# EAGLE design esp_round_lcd (EAGLE 7.7.0)
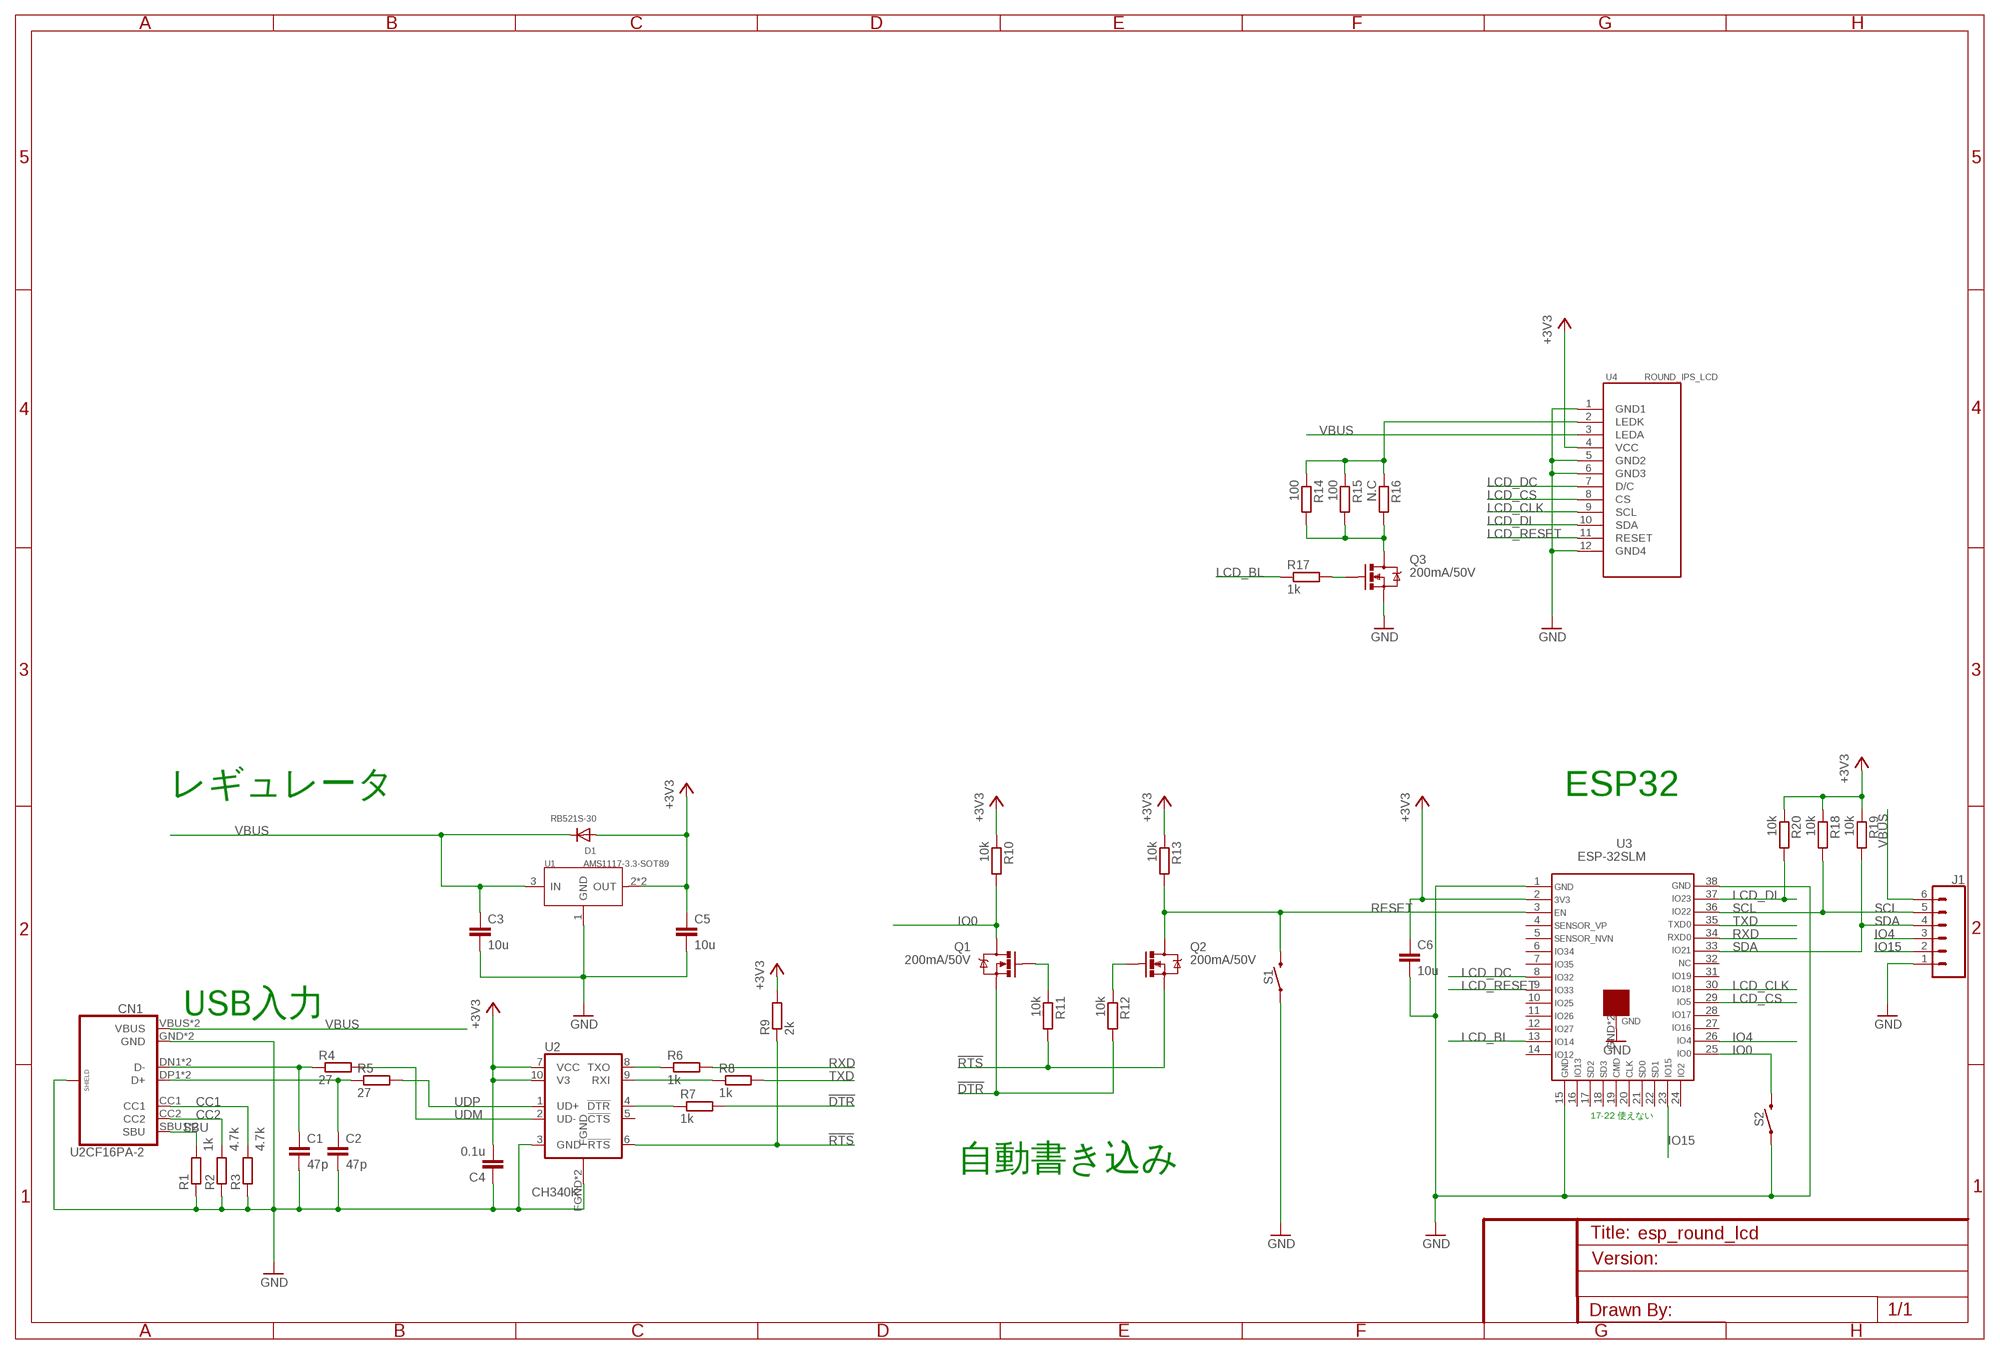
[diagram p0: schematic, sheet 1]

## Parts
C1  47p  C-EU-C1608  [C1608]
C2  47p  C-EU-C1608  [C1608]
C3  10u  C-EU-C1608  [C1608]
C4  0.1u  C-EU-C1608  [C1608]
C5  10u  C-EU-C1608  [C1608]
C6  10u  C-EU-C1608  [C1608]
CN1  U2CF16PA-2  [U2CF16PA]
D1  RB521S-30  DIODESOD-523  [SOD-523]
J1  CONN_06SILK_FEMALE_PTH  [1X06]
Q1  200mA/50V  MOSFET-NCHANNELBSS138  [SOT23-3]
Q2  200mA/50V  MOSFET-NCHANNELBSS138  [SOT23-3]
Q3  200mA/50V  MOSFET-NCHANNELBSS138  [SOT23-3]
R1  1k  R-EU_R0603  [R0603]
R2  4.7k  R-EU_R0603  [R0603]
R3  4.7k  R-EU_R0603  [R0603]
R4  27  R-EU_R0603  [R0603]
R5  27  R-EU_R0603  [R0603]
R6  1k  R-EU_R0603  [R0603]
R7  1k  R-EU_R0603  [R0603]
R8  1k  R-EU_R0603  [R0603]
R9  2k  R-EU_R0603  [R0603]
R10  10k  R-EU_R0603  [R0603]
R11  10k  R-EU_R0603  [R0603]
R12  10k  R-EU_R0603  [R0603]
R13  10k  R-EU_R0603  [R0603]
R14  100  R-EU_R0603  [R0603]
R15  100  R-EU_R0603  [R0603]
R16  N.C  R-EU_R0603  [R0603]
R17  1k  R-EU_R0603  [R0603]
R18  10k  R-EU_R0603  [R0603]
R19  10k  R-EU_R0603  [R0603]
R20  10k  R-EU_R0603  [R0603]
S1  TACT_SW_3X4  [TACTILE_SWITCH_SMD_3X4MM]
S2  TACT_SW_3X4  [TACTILE_SWITCH_SMD_3X4MM]
U1  AMS1117-3.3-SOT89  AMS1117-3.3(SOT-89)  [SOT-89]
U2  CH340K  [ESSOP10]
U3  ESP-32SLM  [ESP32D-SLM]
U4  ROUND_IPS_LCD  [ROUND_IPS_LCD]

## Nets
!DTR: Q1.2(S) R7.2 R12.2
!RTS: Q2.2(S) R9.1 R11.2 U2.6(!RTS)
+3V3 [pow]: C4.2 C5.1 C6.1 D1.A R9.2 R10.1 R13.1 R18.1 R19.1 R20.1 U1.2(OUT) U1.4(OUT) U2.7(VCC) U2.10(V3) U3.2 U4.4(VCC)
CC1: CN1.CC1 R3.2
CC2: CN1.CC2 R2.2
DM: C1.1 CN1.DN1(D-) CN1.DN2(D-) R4.1
DP: C2.1 CN1.DP1(D+) CN1.DP2(D+) R5.1
GND: C1.2 C2.2 C3.2 C4.1 C5.2 C6.2 CN1.GND CN1.GND1(GND) CN1.GND@9(SHIELD) CN1.GND@10(SHIELD) CN1.GND@11(SHIELD) CN1.GND@12(SHIELD) CN1.GND@13(SHIELD) CN1.GND@14(SHIELD) CN1.GND@15(SHIELD) CN1.GND@16(SHIELD) J1.1 Q3.2(S) R1.1 R2.1 R3.1 S1.1 S1.2 S2.1 S2.2 U1.1(GND) U2.3(GND) U2.FGND U2.FGND2(FGND) U3.1 U3.15 U3.38 U3.GND U3.GND2 U4.1(GND1) U4.5(GND2) U4.6(GND3) U4.12(GND4)
IO0: Q1.3(D) R10.2 S2.3 S2.4 U3.25
IO4: J1.3 U3.26
IO15: J1.2 U3.23
LCD_BL: R17.1 U3.13
LCD_CLK: U3.30 U4.9(SCL)
LCD_CS: U3.29 U4.8(CS)
LCD_DC: U3.8 U4.7(D/C)
LCD_DI: R20.2 U3.37 U4.10(SDA)
LCD_RESET: U3.9 U4.11(RESET)
LED_K [usbvcc]: R14.1 R15.1 R16.1 U4.2(LEDK)
N$1: Q3.1(G) R17.2
N$2 [usbvcc]: Q3.3(D) R14.2 R15.2 R16.2
N$7: R8.1 U2.9(RXI)
N$11: R6.1 U2.8(TXO)
N$13: Q2.1(G) R12.1
N$14: Q1.1(G) R11.1
N$16: R7.1 U2.4(!DTR)
RESET: Q2.3(D) R13.2 S1.3 S1.4 U3.3
RXD: R6.2 U3.34
SBU: CN1.SBU1(SBU) CN1.SBU2(SBU) R1.2
SCL: J1.5 R18.2 U3.36
SDA: J1.4 R19.2 U3.33
TXD: R8.2 U3.35
UDM: R4.2 U2.2(UD-)
UDP: R5.2 U2.1(UD+)
VBUS [usbvcc]: C3.1 CN1.VBUS CN1.VBUS1(VBUS) D1.K(C) J1.6 U1.3(IN) U4.3(LEDA)
Unconnected: U2.5(!CTS) U3.4 U3.5 U3.6 U3.7 U3.10 U3.11 U3.12 U3.14 U3.16 U3.17 U3.18 U3.19 U3.20 U3.21 U3.22 U3.24 U3.27 U3.28 U3.31 U3.32

## Notes on the sheet
- レギュレータ | ESP32
- USB入力
- 17-22 使えない
- 自動書き込み

## Library data of the parts
C1-C6 = BS21Lab-Capacitors:C-EU-: CAPACITOR, European symbol
CN1 = suna_lib:U2CF16PA-2
D1 = adafruit:DIODE: Diode SMADIODE - SMA Surface Mount Package 20V 1A Schottky Diode Digikey: 641-1014-6-ND DO-1N4148 - Through Hole Small Current Diode SOD-123 20V 1 A (.5mV Vf) Schottky Diode - Digikey: MBRX120TPMSCT-ND SOD-323 10V 570mA (.38mV Vf, 3ns) Schottky Diode - Digikey: ZLLS410CT-ND SOD-523 30V 30mA Schottky Diode (RB751S-40TE61) - Digikey: RB751S-40TE61CT-ND SOT23-R/W - SOT23 Package (R = Solder Paste/Reflow Ovens, W = Hand-Soldering) BAT54Film 40V 300mA - Digikey: 497-7162-1-ND
J1 = SparkFun-Connectors:CONN_06: Multi connection point. Often used as Generic Header-pin footprint for 0.1 inch spaced/style header connections On any of the 0.1 inch spaced packages, you can populate with these: Break Away Headers - Straight <https://www.sparkfun.com/products/116> (PRT-00116) Break Away Male Headers - Right Angle <https://www.sparkfun.com/products/553> (PRT-00553) Female Headers <https://www.sparkfun.com/products/115> (PRT-00115) Break Away Headers - Machine Pin <https://www.sparkfun.com/products/117> (PRT-00117) Break Away Female Headers - Swiss Machine Pin <https://www.sparkfun.com/products/743> (PRT-00743) Arduino Stackable Header - 6 Pin <https://www.sparkfun.com/products/9280> (PRT-09280) For SCREWTERMINALS and SPRING TERMINALS visit here: Screw Terimnals on SparkFun.com <https://www.sparkfun.com/search/results?term=Screw+Terminals> (5mm/3.5mm/2.54mm spacing) This device is also useful as a general connection point to wire up your design to another part of your project. Our various solder wires solder well into these plated through hole pads. Hook-Up Wire - Assortment (Stranded, 22 AWG) <https://www.sparkfun.com/products/11375> (PRT-11375) Hook-Up Wire - Assortment (Solid Core, 22 AWG) <https://www.sparkfun.com/products/11367> (PRT-11367) View the entire wire category on our website here <https://www.sparkfun.com/categories/141>; PROD_ID: CONN-08437
Q1 Q2 = SparkFun-DiscreteSemi:MOSFET-NCHANNEL: Common NMOSFET Parts MFG P/N Store ID Prod ID FDD8780 TRANS-09984 SI7820DN TRANS-11055 FDS6630A IC-08089 2N7002PW TRANS-11151 FQP30N06L COM-10213 TRANS-10060 BSS123LT1G TRANS-08345 BSS138 TRANS-00830 BS170 2N7000; PROD_ID: TRANS-00830
Q3 = suna_lib:MOSFET-NCHANNEL: Common NMOSFET Parts MFG P/N Store ID Prod ID FDD8780 TRANS-09984 SI7820DN TRANS-11055 FDS6630A IC-08089 2N7002PW TRANS-11151 FQP30N06L COM-10213 TRANS-10060 BSS123LT1G TRANS-08345 BSS138 TRANS-00830 BS170 2N7000; PROD_ID: TRANS-00830
R1-R20 = resistor:R-EU_: RESISTOR, European symbol
S1 S2 = suna_lib:TACT_SW_3X4
U1 = suna_lib:AMS1117-3.3(SOT-89): 310030095; MPN: AMS1117-3.3
U2 = suna_lib:CH340K
U3 = suna_lib:ESP-32
U4 = suna_lib:ROUND_IPS_LCD

## Net classes
1 pow: width 0.508 mm
2 GND: width 0.61 mm
3 usbvcc: width 0.508 mm, clearance 0.254 mm
4 aref: width 0.406 mm, clearance 0.254 mm

## Board
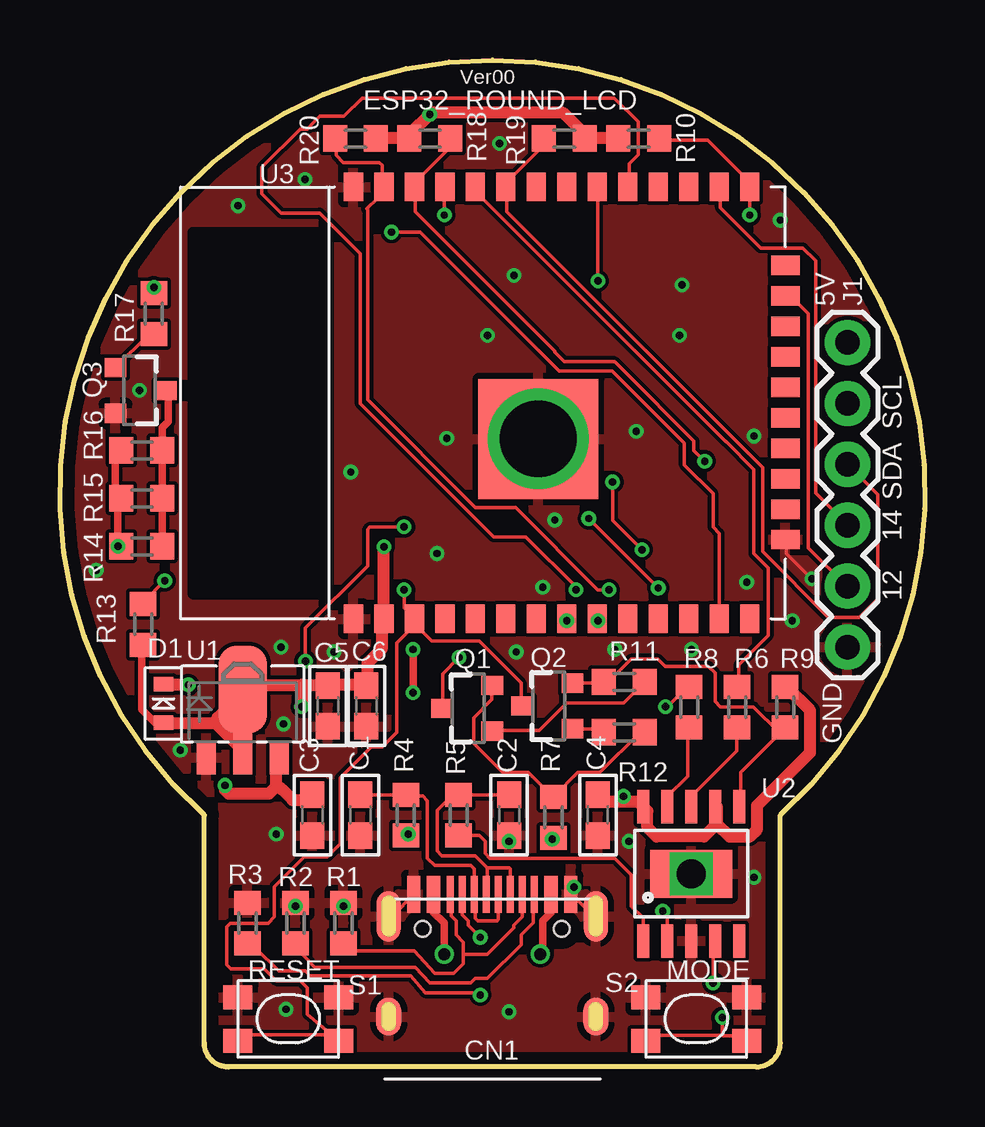
[diagram p1: board, top side]
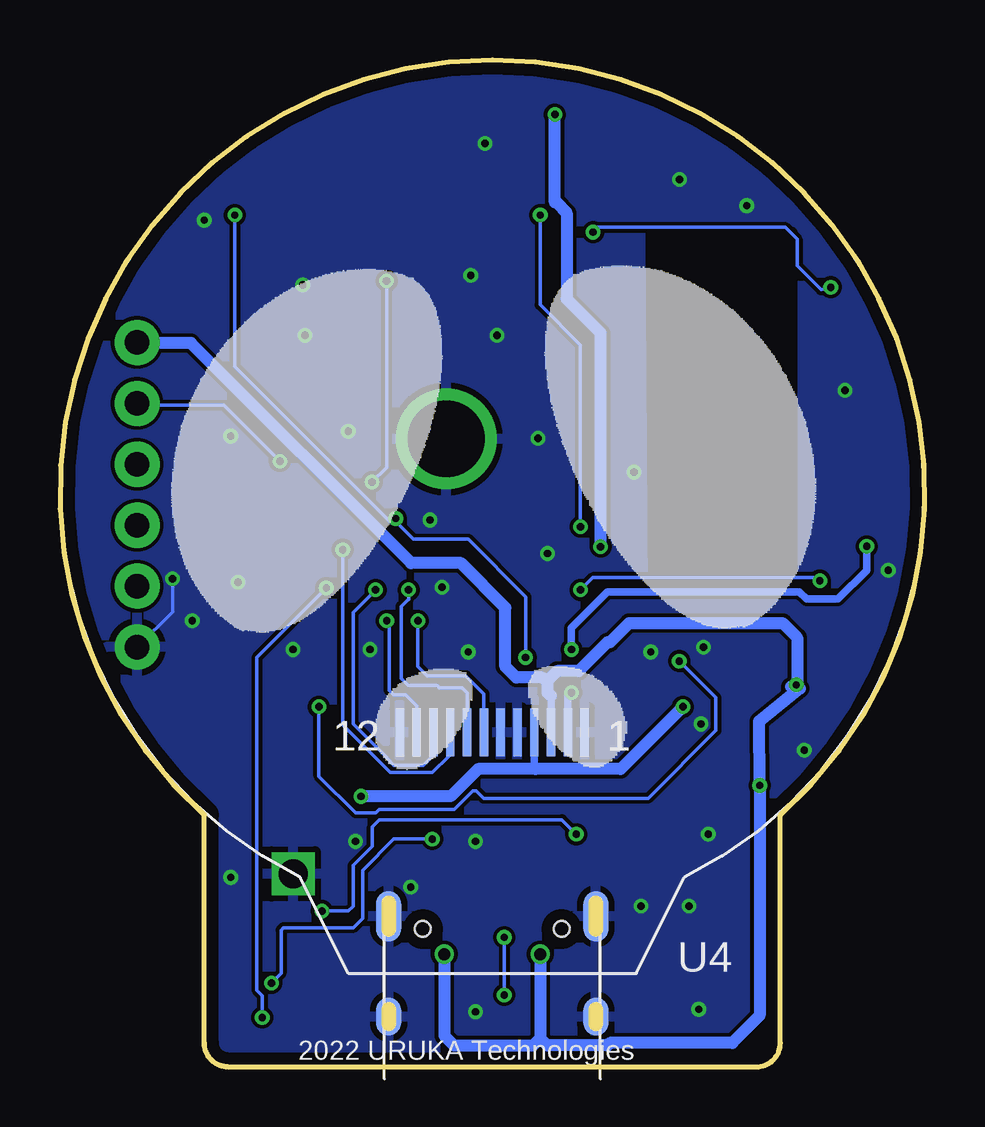
[diagram p2: board, bottom side, seen from below]

Size 36.02 x 41.98 mm. Coordinates in mm from the lower left corner, seen from the top.
Outline: 29.01,0 7.01,0 arc-90 6.01,1 6.01,10.5 arc-277 30.01,10.5 30.01,1 arc-90 29.01,0
Copper layers (1*16): Top 0.035mm / dielectric 1.53mm / Bottom 0.035mm
Design rules "seeed_pban_5mil": minimum track width 6mil, minimum drill 12mil, track to track 6mil, track to pad 0.229mm, pad to pad 6mil, via to via 6mil, smd to smd 5mil, copper to edge 0.5mm, drill to drill 0.5mm, minimum pad ring 10mil, minimum via ring 6mil, stop-mask expansion 4mil, vias tented up to drill 25mil, thermal gap 10mil
tRestrict: area 5.5,19.7 to 11.2,34.8
bRestrict: area 5.5,19.7 to 11.4,34.8

### Footprints (pad centres in the part's own frame; a part is rotated, then mirrored left to right if it is on the bottom)
C1608 = smd 1.1 x 1: 1 -0.85,0; 2 0.85,0
U2CF16PA = smd 1.55 x 0.3: CC1 7.695,1.25; CC2 7.695,-1.75; DN1 7.695,-0.25; DN2 7.695,0.75; DP1 7.695,0.25; DP2 7.695,-0.75; SBU1 7.695,-1.25; SBU2 7.695,1.75 | smd 1.55 x 0.55: GND 7.695,3.27; GND1 7.695,-3.27 | smd 1.6 x 1.05: GND@9 2.6,4.32; GND@11 2.6,-4.32 | smd 2.1 x 1: GND@10 6.78,4.32; GND@12 6.78,-4.32 | smd 1.6 x 1.05 bottom: GND@13 2.6,4.32; GND@15 2.6,-4.32 | smd 2.1 x 1.05 bottom: GND@14 6.78,4.32; GND@16 6.78,-4.32 | smd 1.55 x 0.56: VBUS 7.695,2.45; VBUS1 7.695,-2.45 | hole 0.65: 6.25,-2.89; 6.25,2.89
SOD-523 = smd 0.8 x 0.6: A 0,-0.8; K 0,0.8
1X06 = drill 1.016 pad 1.88: 1 0,0; 2 2.54,0; 3 5.08,0; 4 7.62,0; 5 10.16,0; 6 12.7,0
SOT23-3 = smd 0.8 x 0.9: 1 -0.95,-1; 2 0.95,-1; 3 0,1.1
R0603 = smd 1 x 1.1: 1 -0.85,0; 2 0.85,0
TACTILE_SWITCH_SMD_3X4MM = smd 1.2 x 1: 1 -2.1,-0.9; 2 2.1,-0.9; 3 2.1,0.9; 4 -2.1,0.9
SOT-89 = smd 0.8 x 1.4: 1 -1.524,-1.905; 3 1.524,-1.905 | smd 0.8 x 1.9: 2 0,-1.651 | smd 2.032 x 3.65: 4 0,0.94
ESSOP10 = smd 0.5 x 1.4: 1 -2,-2.8; 2 -1,-2.8; 3 0,-2.8; 4 1,-2.8; 5 2,-2.8; 6 2,2.8; 7 1,2.8; 8 0,2.8; 9 -1,2.8; 10 -2,2.8 | smd 3.4 x 2: FGND 0,0 | drill 1.2 square: FGND2 0,0
ESP32D-SLM = smd 1.2 x 0.8: 1 0,0; 2 0,-1.27; 3 0,-2.54; 4 0,-3.81; 5 0,-5.08; 6 0,-6.35; 7 0,-7.62; 8 0,-8.89; 9 0,-10.16; 10 0,-11.43; 11 0,-12.7; 12 0,-13.97; 13 0,-15.24; 14 0,-16.51; 25 18,-16.51; 26 18,-15.24; 27 18,-13.97; 28 18,-12.7; 29 18,-11.43; 30 18,-10.16; 31 18,-8.89; 32 18,-7.62; 33 18,-6.35; 34 18,-5.08; 35 18,-3.81; 36 18,-2.54; 37 18,-1.27; 38 18,0 | smd 0.8 x 1.2: 15 3.3,-18; 16 4.57,-18; 17 5.84,-18; 18 7.11,-18; 19 8.38,-18; 20 9.65,-18; 21 10.92,-18; 22 12.19,-18; 23 13.46,-18; 24 14.73,-18 | smd 5 x 5: GND 7.5,-7.7 | drill 3.2: GND2 7.5,-7.7
ROUND_IPS_LCD = smd 0.35 x 2: 1 3.85,-9.95; 2 3.15,-9.95; 3 2.45,-9.95; 4 1.75,-9.95; 5 1.05,-9.95; 6 0.35,-9.95; 7 -0.35,-9.95; 8 -1.05,-9.95; 9 -1.75,-9.95; 10 -2.45,-9.95; 11 -3.15,-9.95; 12 -3.85,-9.95

### Placement (x,y rotation side)
C1  12.51,10.5 270 top
C2  18.71,10.5 270 top
C3  10.51,10.5 270 top
C4  22.41,10.5 90 top
C5  11.16,15.05 270 top
C6  12.76,15.05 270 top
CN1  18.01,-0.5 90 top
D1  4.31,15.15 0 top
J1  32.81,17.5 90 top
Q1  17.01,14.95 90 top
Q2  20.36,15.05 90 top
Q3  3.31,28.2 270 top
R1  11.81,6 270 top
R2  9.81,6 270 top
R3  7.81,6 270 top
R4  14.41,10.5 270 top
R5  16.61,10.5 270 top
R6  28.21,15 90 top
R7  20.56,10.4 90 top
R8  26.21,15 90 top
R9  30.21,15 90 top
R10  24.11,38.7 0 top
R11  23.51,16.05 180 top
R12  23.51,13.95 0 top
R13  3.46,18.45 90 top
R14  3.41,21.7 0 top
R15  3.41,23.7 0 top
R16  3.41,25.7 0 top
R17  3.91,31.4 270 top
R18  15.41,38.7 0 top
R19  21.01,38.7 180 top
R20  12.31,38.7 180 top
S1  9.51,2 180 top
S2  26.51,2 180 top
U1  7.61,14.8 0 top
U2  26.3,8.05 0 top
U3  12.23,18.68 90 top
U4  18.01,23.9 0 bottom
U$1  [OSHIOKI]  34.01,9 0 bottom

### Tracks (layer width: path | path; a pad name or v marks a point on that pad's centre or on a via)
!DTR
  Top 0.152: Q1.2 18,15.85 18,15.32 17.23,14.55 17.23,13.49 18.45,12.27 19.52,12.27 20.51,11.28 R7.2 20.59,11.28 21.58,12.27 22.49,12.27 24.17,13.95 24.32,13.95 R12.2
!RTS
  Top 0.152: U2.6 28.36,10.9 28.36,12.27 30.19,14.1 R9.1 29.96,13.95 28.89,15.01 27.52,15.01 27.29,15.24 27.29,16.42 27.01,16.7 25.21,16.7 24.91,17 23.79,17 22.87,16.08 22.72,16.08 R11.2 22.64,16 21.42,16 Q2.2
+3V3  (via drill 0.3)
  Top 0.254: 3.41,17.75 3.46,17.75 R13.1
  Top 0.305: D1.A 3.96,14.35 3.41,14.9 3.41,17.75
  Top 0.508: 6.49,14.33 4.36,14.33 D1.A | 6.49,14.33 7.63,13.18 U1.2 | 7.56,16.38 7.56,15.77 U1.4 | 6.49,14.33 6.57,14.55 7.56,15.54 U1.4 | 10.07,15.93 7.78,15.93 U1.4 | 10.07,15.93 10.91,15.93 C5.1 11.21,15.93 12.74,15.93 C6.1 12.81,16.15 12.81,16.84 13.42,17.45 13.42,18.67 U3.2 13.5,18.9 v13.5,21.69 | 23.48,11.05 24.09,11.05 24.24,10.9 U2.10 24.47,10.67 24.47,9.98 24.85,9.6 26.83,9.6 27.37,10.13 | 23.48,11.05 22.42,11.05 C4.2 | 27.37,10.13 27.9,9.6 28.74,9.6 29.04,9.91 29.04,10.9 31.25,13.11 31.25,14.86 30.26,15.85 R9.2 | 27.37,10.13 27.37,10.82 U2.7 | R20.1 13.2,38.71 14.49,38.71 R18.1 14.64,38.94 v15.4,39.7 15.48,39.78 20.97,39.78 21.81,38.94 R19.1 21.88,38.71 R10.1 | 10.07,15.93 v10.07,15.01 | v23.48,11.28 23.48,11.05
  Bottom 0.305: U4.4 16.26,12.47 16.21,12.42
  Bottom 0.508: v15.4,39.7 15.4,36.04 15.36,36.04 14.91,35.6 14.91,32.01 13.5,30.6 v13.5,21.69 | v23.48,11.28 19.75,11.28 18.61,12.42 16.21,12.42 12.66,12.42 v10.07,15.01
CC1  (via drill 0.3)
  Top 0.152: R3.2 8.16,4.95 9.11,4 10.21,4 10.41,3.8 14.61,3.8 15.21,3.1 17.41,3.1 v17.51,3 | CN1.CC1 16.76,6.35 17.01,6.1 17.01,5.9 v17.51,5.4
  Bottom 0.152: v17.51,5.4 v17.51,3
CC2
  Top 0.152: R2.2 9.86,4.95 10.61,4.15 14.81,4.15 15.41,3.5 17.11,3.5 17.31,3.7 17.81,3.7 19.21,5.1 19.21,5.5 19.71,6 19.71,7.14 CN1.CC2
DM
  Top 0.152: C1.1 R4.1 14.56,11.3 15.11,11.3 15.31,11.1 15.31,8.7 15.61,8.4 17.11,8.4 17.26,8.25 CN1.DN2 17.31,7.14 17.31,6.2 17.41,6.1 18.21,6.1 18.26,6.15 CN1.DN1
DP
  Top 0.152: 18.76,11.05 C2.1 R5.1 | 17.81,7.14 CN1.DP1 17.81,7.25 17.81,8.3 | R5.1 16.61,11 | R5.1 16.36,11.1 16.11,11.1 15.71,10.7 15.71,9 15.91,8.8 17.31,8.8 17.81,8.3 | CN1.DP2 18.76,8.25 18.71,8.3 17.81,8.3
GND  (via drill 0.3)
  Top 0.152: CN1.GND 14.72,7.16 13.88,6.33 13.88,6.02 13.8,5.94 13.35,5.94 13.35,6.02 13.8,6.02 13.8,6.17 CN1.GND@14 | CN1.GND@16 22.26,6.25 21.35,7.16 CN1.GND1 21.41,7.33 v21.41,7.5 | v31.33,20.34 30.26,21.41 30.26,21.95 U3.15 | U3.38 12.28,36.73 12.23,36.73
  Bottom 0.152: v31.33,20.34 31.33,18.97 32.78,17.53 J1.1 | 14.19,13.95 U4.1 | U4.1 | U4.1 14.26,13.95 U4.1
  other vias: 10.21,37 7.41,35.9 18.31,38.5 30.01,35.3 25.91,32.6 17.81,30.5 24.01,26.5 12.11,24.8 16.11,26.2 20.61,22.8 9.21,17.5 25.81,30.5 15.71,21.4 28.61,20.2 30.51,18.6 28.91,7.9 23.71,9.4 18.71,2.3 9.31,14.3 5.01,13.2 1.51,20.7 18.71,9.4 9.01,9.7 11.41,17.3 9.81,6.7 11.81,6.7 18.91,33 9.41,2.4 20.11,20 19.01,17.3 23.11,17.4 26.31,17.4 3.31,28.2 28.91,26.3
  pour Bottom: -3.49,-3.8 39.41,-3.8 39.41,42.8 -3.49,42.8
  pour Top: -2.99,-3.3 38.01,-3.3 38.01,44.1 -2.99,44.1
IO0  (via drill 0.3)
  Top 0.152: 24.47,1.22 S2.3 24.63,1.32 27.6,1.32 | 28.51,1.22 S2.4 28.41,1.3 27.61,1.3 27.6,1.32 | v16.62,17.07 15.94,16.38 15.94,15.01 Q1.3 | v28.74,35.51 28.74,36.65 U3.25 28.66,36.73 28.66,36.96 26.99,38.63 25.01,38.63 R10.2 | v22.03,22.86 v24.93,19.96 | v27.6,2.06 27.6,1.32
  Bottom 0.152: 22.22,22.67 28.74,29.18 v28.74,35.51 | v27.6,2.06 27.6,2.97 27.83,3.2 27.83,17.07 v24.93,19.96 | 22.22,22.67 v22.03,22.86 | 22.22,22.67 21.98,22.67 21.31,22 19.01,22 16.61,19.6 v16.61,17.08 v16.62,17.07
IO4
  Top 0.152: U3.26 27.52,36.65 27.52,35.81 29.2,34.14 30.95,34.14 31.48,33.6 31.48,23.93 32.78,22.63 J1.3
IO15
  Top 0.152: U3.23 30.26,32.08 30.49,32.08 31.18,31.39 31.18,21.64 32.78,20.04 J1.2
LCD_BL  (via drill 0.3)
  Top 0.152: U3.13 27.47,22.24 27.21,22.5 27.21,23.9 26.01,25.1 26.01,26 23.01,29 20.81,29 15.01,34.8 v13.81,34.8 | v3.91,32.5 R17.1
  Top 0.305: R17.1 3.91,32.3
  Bottom 0.152: v3.91,32.5 4.31,32.4 5.31,33.4 5.31,34.5 5.81,35 13.61,35 v13.81,34.8
LCD_CLK  (via drill 0.3)
  Top 0.152: v22.42,32.77 22.42,36.65 U3.30 | v23.02,24.38 23.02,22.78 v24.24,21.57
  Bottom 0.152: v22.42,32.77 22.42,24.99 v23.02,24.38 | v24.24,21.57 24.24,14.25 22.26,12.27 20.51,12.27 19.82,12.95 19.82,13.95 U4.9
LCD_CS  (via drill 0.3)
  Top 0.152: U3.29 23.71,36.73 23.71,37.64 24.09,38.02 24.09,39.4 23.1,40.39 12.59,40.39 11.82,39.62 10.83,39.62 10.6,39.4 10.6,39.39 10.31,39.1 10.01,39.1 8.41,37.5 8.41,36.4 9.21,35.6 10.82,35.6 12.51,33.91 12.51,27.66 18.07,22.1 19.41,22.1 21.5,20.01 v21.5,19.89
  Bottom 0.152: v21.5,19.89 21.5,19.49 21.52,19.49 21.81,19.2 21.81,16.2 21.51,15.9 20.31,15.9 20.21,15.8 19.26,15.8 19.06,15.6 U4.8
LCD_DC  (via drill 0.3)
  Top 0.152: v21.11,18.6 U3.8
  Bottom 0.152: U4.7 18.36,15.55 19.11,16.3 20.71,16.3 21.11,16.7 v21.11,18.6
LCD_DI  (via drill 0.3)
  Top 0.152: 13.42,36.65 13.42,36.42 | 11.52,38.63 R20.2 11.51,38.65 11.51,38 11.81,37.7 13.31,37.7 13.42,37.59 13.42,36.65 | 13.42,36.65 U3.37 13.21,36.39 13.21,36.2 12.79,35.78 12.78,35.78 12.81,35.74 12.81,27.81 17.31,23.32 18.99,23.32 22.42,19.89 v22.87,19.89
  Bottom 0.152: U4.10 20.51,13.95 20.51,12.95 20.89,12.57 22.11,12.57 22.42,12.88 22.42,12.9 23.81,14.3 23.81,18.95 v22.87,19.89
LCD_RESET  (via drill 0.3)
  Top 0.152: v22.41,18.6 22.31,18.6 U3.9
  Bottom 0.152: U4.11 21.16,15.05 21.61,15.5 22.11,15.5 22.31,15.7 22.31,18.5 v22.41,18.6
LED_K  (via drill 0.3)
  Top 0.152: R14.1 v2.41,21.7
  Top 0.305: v14.71,17.4 v14.71,15.6 | v2.41,21.7 2.41,23.55 R15.1 2.56,23.85 2.31,24.1 2.31,25.45 R16.1
  Bottom 0.305: v14.71,17.4 14.71,18.3 13.21,19.8 5.21,19.8 4.91,19.5 3.61,19.5 2.41,20.7 v2.41,21.7 | U4.2 14.86,15.55 v14.71,15.6
N$1
  Top 0.152: R17.2 3.71,30.55 Q3.1
N$2
  Top 0.305: R14.2 R15.2 R16.2 4.26,26.65 4.51,26.9 4.51,28.1 Q3.3
N$7
  Top 0.152: R8.1 26.15,14.1 26.15,12.12 25.31,11.28 25.31,10.9 U2.9
N$11
  Top 0.152: R6.1 28.21,14.1 28.21,13.18 26.38,11.35 26.38,10.9 U2.8
N$13
  Top 0.152: Q2.1 21.42,14.1 22.57,14.1 22.64,14.02 R12.1
N$14
  Top 0.152: Q1.1 18.07,14.02 19.98,14.02 21.12,15.16 23.48,15.16 24.32,16 R11.1
N$16  (via drill 0.3)
  Top 0.152: R7.1 v20.51,9.5 | v27.21,3.5 27.21,5.16 U2.4
  Bottom 0.152: v20.51,9.5 22.11,9.5 23.41,8.2 23.41,6.2 23.81,5.8 26.71,5.8 26.81,5.7 26.81,3.9 v27.21,3.5
RESET  (via drill 0.3)
  Top 0.152: S1.3 7.48,1.22 7.48,1.33 11.38,1.33 S1.4 | 11.52,1.22 S1.4 | 14.8,18.44 15.48,17.75 17.46,17.75 19.21,16 19.21,15.09 Q2.3 | 14.8,18.44 14.8,18.67 U3.3 | v14.34,19.89 14.34,19.13 14.72,18.75 U3.3 | 14.8,18.44 14.03,17.68 14.03,13.95 13.42,13.34 12.97,13.34 11.67,12.04 11.67,9.3 11.14,8.76 10.18,8.76 8.93,7.51 8.93,6.25 8.67,5.99 7.1,5.99 6.95,5.84 6.95,4.27 7.11,4.1 8.51,4.1 9.01,3.6 10.01,3.6 10.31,3.3 10.31,2.2 S1.4 | 14.8,18.44 U3.3 | v4.37,20.27 3.46,19.37 R13.2 3.52,19.36 3.52,19.67
  Bottom 0.152: v14.34,19.89 13.83,20.4 4.49,20.4 v4.37,20.27
RXD
  Top 0.152: R6.2 28.28,15.93 28.28,16.76 29.5,17.98 29.5,20.8 28.91,21.39 28.91,24.9 27.75,26.06 17.31,36.5 17.31,36.65 U3.34
SBU
  Top 0.152: 16.81,4.7 16.81,4.3 16.41,3.9 15.61,3.9 14.76,4.85 11.91,4.85 R1.2 | 16.81,4.7 16.81,5.2 16.51,5.5 16.51,6.1 16.31,6.3 16.31,7.14 CN1.SBU2 | CN1.SBU1 19.26,6.25 18.91,5.9 18.91,5.8 17.81,4.7 16.81,4.7
SCL  (via drill 0.3)
  Top 0.152: R18.2 16.24,38.63 16.24,38.33 14.8,36.88 14.8,36.73 U3.36 14.8,36.65 14.8,35.66 20.61,29.84 20.61,29.8 21.01,29.4 23.11,29.4 23.48,29.03 26.41,26.1 26.41,25.7 v26.86,25.25
  Bottom 0.152: v26.86,25.25 29.2,27.58 32.78,27.58 J1.5
SDA
  Top 0.152: R19.2 20.13,38.63 20.13,38.41 18.61,36.88 18.61,36.73 U3.33 18.61,36.65 18.61,35.66 29.27,24.99 29.27,21.49 32.02,18.75 33.31,18.75 34.07,19.51 34.07,23.85 32.85,25.07 J1.4
TXD  (via drill 0.3)
  Top 0.152: v25.23,15.01 25.31,15.01 26.15,15.85 R8.2 | v10.22,16.92 10.22,18.29 12.81,20.88 12.81,22.4 12.91,22.5 14.32,22.5 v14.34,22.52 | v16.01,35.51 16.01,36.65 U3.35
  Bottom 0.152: v25.23,15.01 25.23,12.12 23.71,10.59 22.87,10.59 22.72,10.74 19.6,10.74 18.83,11.51 18.68,11.51 18.38,11.2 11.52,11.2 8.7,14.02 8.7,15.39 v10.22,16.92 | v14.34,22.52 14.34,30.1 16.01,31.77 v16.01,35.51
UDM  (via drill 0.3)
  Top 0.152: U2.2 25.3,6.31 v25.11,6.5 | v14.51,9.7 R4.2
  Bottom 0.152: v25.11,6.5 24.01,6.5 23.81,6.7 23.81,8.4 23.01,9.2 23.01,10 22.71,10.3 15.11,10.3 v14.51,9.7
UDP
  Top 0.152: U2.1 24.3,6.21 23.81,6.7 23.81,8 23.11,8.7 17.91,8.7 17.71,8.9 17.71,9.4 17.46,9.65 R5.2
VBUS  (via drill 0.3, 0.5)
  Top 0.305: CN1.VBUS 15.56,6.45 16.01,6 v16.01,4.7 | CN1.VBUS1 20.46,6.45 20.11,6.1 20.11,4.8 v20.01,4.7
  Top 0.508: v5.35,15.93 4.36,15.93 D1.K | v6.87,11.73 6.87,11.54 7.01,11.4 8.71,11.4 9.01,11.7 | 9.01,11.7 9.01,12.77 U1.3 | C3.1 10.45,11.12 9.69,11.12 9.23,11.58 9.01,11.7
  Bottom 0.305: U4.3 15.56,15.28 15.58,15.47
  Bottom 0.508: v5.35,15.93 5.19,15.77 6.89,14.41 v6.87,11.73 6.87,2.14 8.01,1 13.11,1 13.21,0.9 15.71,0.9 16.01,1.2 | 5.58,15.85 v5.35,15.93 | v16.01,4.7 16.01,1.2 | v20.01,4.7 20.01,1.3 19.61,0.9 16.31,0.9 16.01,1.2 | v5.35,15.93 5.31,15.96 5.31,17.9 5.91,18.5 12.31,18.5 13.11,17.7 13.21,17.7 14.41,16.5 15.31,16.5 15.71,16.1 | 15.71,16.1 15.71,15.61 15.58,15.47 | J1.6 32.78,30.18 30.57,30.18 21.39,21 19.31,21 17.46,19.15 17.46,16.69 17.01,16.23 15.94,16.23 15.71,16.1

### Text on the board
tPlace: Ver00 | ESP32_ROUND_LCD | 5V | SCL | SDA | 14 | 12 | GND | RESET | MODE
bPlace: 2022 URUKA Technologies